# Altium project DevBoardSt107.PrjPcb
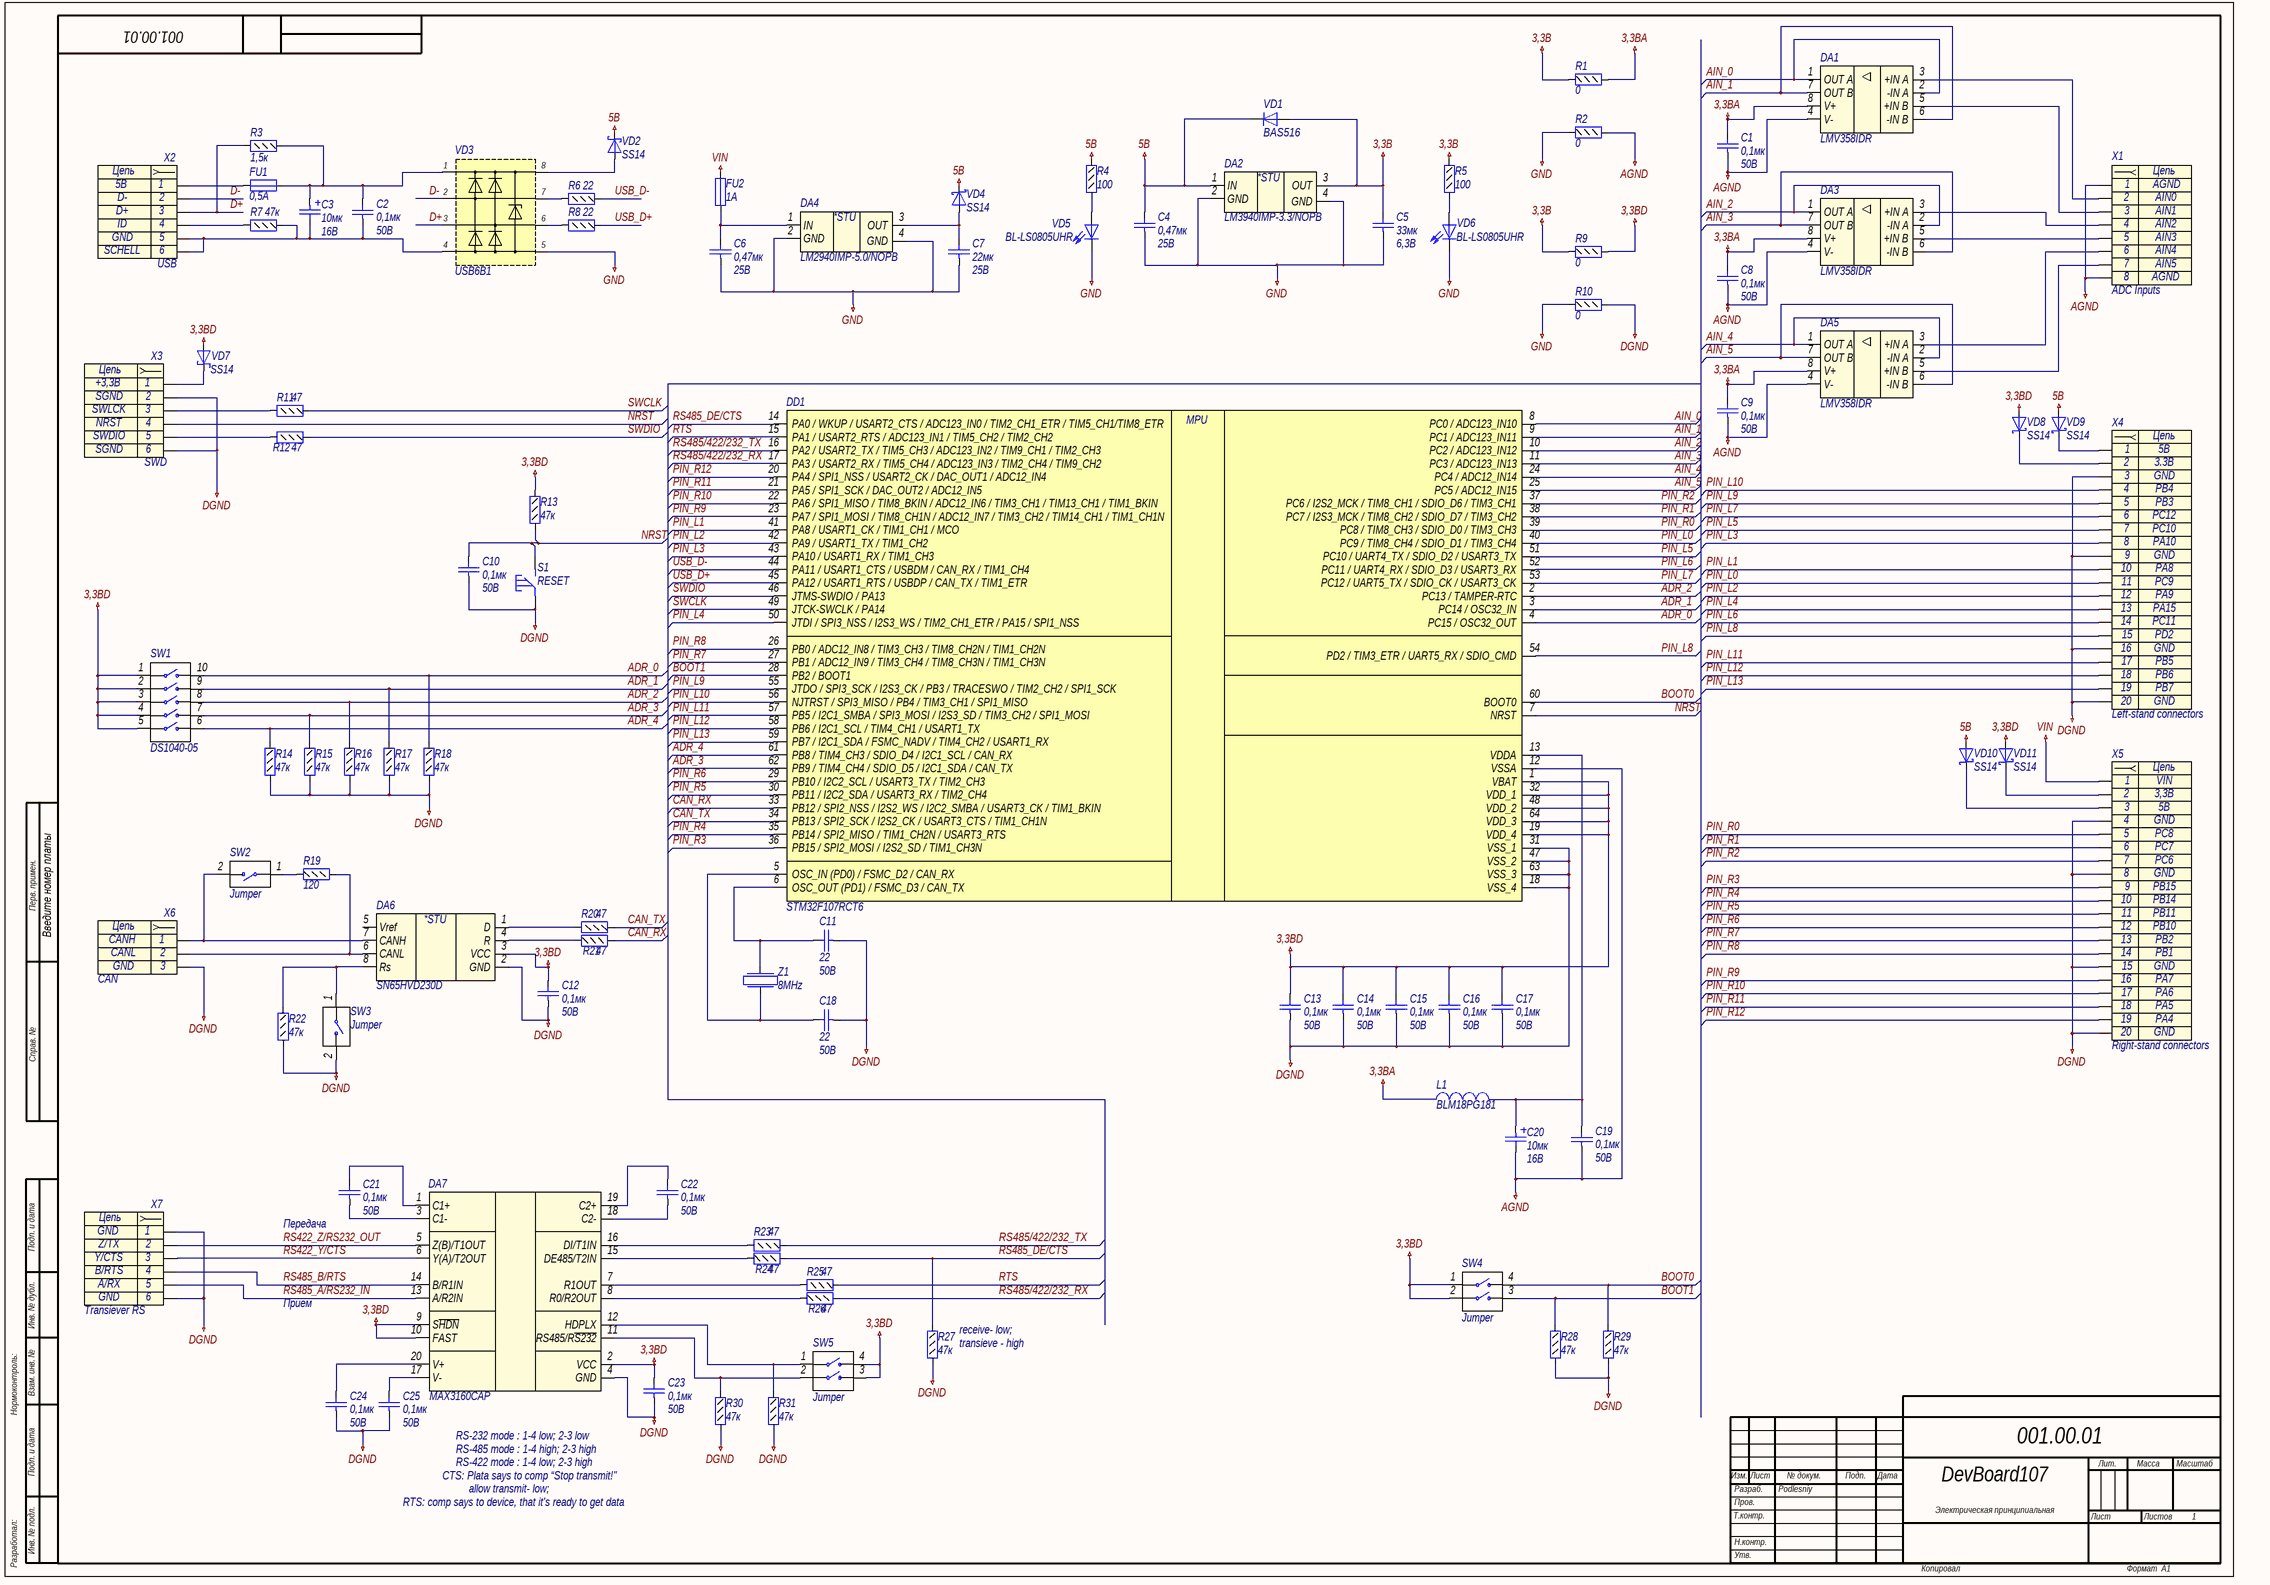
[diagram p0: DevBoardSt107.SchDoc]
1 sheet, 92 parts. Net scope: global (net labels, ports and power ports of the same name join across sheets).
Board file: DevBoardSt107.PcbDoc

## Sheet DevBoardSt107.SchDoc: DevBoard107
size 840 x 594 mm; DrawnBy: Podlesniy; DocumentNumber: 001.00.01; SheetTotal: 1; DocumentType: Электрическая принципиальная; Format: A1; ImagePath: Введите номер платы

### Parts
C1  0,1мк  Voltage: 50В  [C0603]
C2  0,1мк  Voltage: 50В  [C0603]
C3  10мк  Voltage: 16В  [TANTAL CASE B]
C4  0,47мк  Voltage: 25В  [C0603]
C5  33мк  Voltage: 6,3В  [C1210]
C6  0,47мк  Voltage: 25В  [C0603]
C7  22мк  Voltage: 25В  [C1210]
C8  0,1мк  Voltage: 50В  [C0603]
C9  0,1мк  Voltage: 50В  [C0603]
C10  0,1мк  Voltage: 50В  [C0603]
C11  22  Voltage: 50В  [C0603]
C12  0,1мк  Voltage: 50В  [C0603]
C13  0,1мк  Voltage: 50В  [C0603]
C14  0,1мк  Voltage: 50В  [C0603]
C15  0,1мк  Voltage: 50В  [C0603]
C16  0,1мк  Voltage: 50В  [C0603]
C17  0,1мк  Voltage: 50В  [C0603]
C18  22  Voltage: 50В  [C0603]
C19  0,1мк  Voltage: 50В  [C0603]
C20  10мк  Voltage: 16В  [TANTAL CASE B]
C21  0,1мк  Voltage: 50В  [C0603]
C22  0,1мк  Voltage: 50В  [C0603]
C23  0,1мк  Voltage: 50В  [C0603]
C24  0,1мк  Voltage: 50В  [C0603]
C25  0,1мк  Voltage: 50В  [C0603]
DA1  LMV358IDR  [SO8]
DA2  LM3940IMP-3.3/NOPB  [SOT-223]
DA3  LMV358IDR  [SO8]
DA4  LM2940IMP-5.0/NOPB  [SOT-223]
DA5  LMV358IDR  [SO8]
DA6  SN65HVD230D  [SO8]
DA7  MAX3160CAP  [SSOP20]
DD1  STM32F107RCT6  [LQFP64]
FU1  value 0,5A  [FUSE812]  (hidden comment: MF-MSMF050)
FU2  value 1A  [FUSE812]  (hidden comment: MF-MSMF075)
L1  Name: BLM18PG181  [L0603]  (hidden comment: XXX)
R1  0  [R0603]
R2  0  [R0603]
R3  1,5к  [R0603]
R4  100  [R0603]
R5  100  [R0603]
R6  22  [R0603]
R7  47к  [R0603]
R8  22  [R0603]
R9  0  [R0603]
R10  0  [R0603]
R11  47  [R0603]
R12  47  [R0603]
R13  47к  [R0603]
R14  47к  [R0603]
R15  47к  [R0603]
R16  47к  [R0603]
R17  47к  [R0603]
R18  47к  [R0603]
R19  120  [R0603]
R20  47  [R0603]
R21  47  [R0603]
R22  47к  [R0603]
R23  47  [R0603]
R24  47  [R0603]
R25  47  [R0603]
R26  47  [R0603]
R27  47к  [R0603]
R28  47к  [R0603]
R29  47к  [R0603]
R30  47к  [R0603]
R31  47к  [R0603]
S1  RESET  [DTSM 32]
SW1  DS1040-05  [DIP5]
SW2  Jumper  [PLS2-2]
SW3  Jumper  [PLS2-2]
SW4  Jumper  [PLS2-4]
SW5  Jumper  [PLS2-4]
VD1  BAS516  [SOD523]
VD2  SS14  [SMA]
VD3  USB6B1  [SO8]
VD4  SS14  [SMA]
VD5  BL-LS0805UHR  [D0805]
VD6  BL-LS0805UHR  [D0805]
VD7  SS14  [SMA]
VD8  SS14  [SMA]
VD9  SS14  [SMA]
VD10  SS14  [SMA]
VD11  SS14  [SMA]
X1  ADC Inputs  [PLS-8]
X2  USB  [USB-B Micro]
X3  SWD  [PLS2-6]
X4  Left-stand connectors  [PLS-20-2]
X5  Right-stand connectors  [PLS-20-2]
X6  CAN  [TERMINAL 3 way-2.54mm]
X7  Transiever RS  [TERMINAL 6 way-2.54mm]
Z1  8MHz  [QSMD5.0x3.2x1.0]

### Nets
3,3В: C5.2 DA2.3(OUT) R1.2 R5.2 R9.2 VD1.2(A)
3,3ВA: C1.2 C8.2 C9.2 DA1.8(V+) DA3.8(V+) DA5.8(V+) L1.1 R1.1
3,3ВD: C12.2 C13.2 C14.2 C15.2 C16.2 C17.2 C23.2 DA6.3(VCC) DA7.2(VCC) DA7.9(S~{HDN}) DA7.10(FAST) DD1.1(VBAT) DD1.19(VDD_4) DD1.32(VDD_1) DD1.48(VDD_2) DD1.64(VDD_3) R9.1 R13.2 SW1.1 SW1.2 SW1.3 SW1.4 SW1.5 SW4.1 SW4.2 SW5.3 SW5.4 VD7.2(A) VD8.2(A) VD11.2(A)
5В: C4.2 DA2.1(IN) R4.2 VD1.1(K) VD2.1(K) VD4.1(K) VD9.2(A) VD10.2(A)
AGND: C1.1 C8.1 C9.1 C19.1 C20.2 DA1.4(V-) DA3.4(V-) DA5.4(V-) DD1.12(VSSA) R2.1 X1.1 X1.8
DGND: C10.1 C11.1 C12.1 C13.1 C14.1 C15.1 C16.1 C17.1 C18.1 C23.1 C24.1 C25.1 DA6.2(GND) DA7.4(GND) DD1.18(VSS_4) DD1.31(VSS_1) DD1.47(VSS_2) DD1.63(VSS_3) R10.1 R14.1 R15.1 R16.1 R17.1 R18.1 R22.1 R27.1 R28.1 R29.1 R30.1 R31.1 S1.1 SW3.2 X3.2 X3.6 X4.3 X4.9 X4.16 X4.20 X5.4 X5.8 X5.15 X5.20 X6.3 X7.1 X7.6
GND: C4.1 C5.1 C6.1 C7.1 DA2.2(GND) DA2.4(GND) DA4.2(GND) DA4.4(GND) R2.2 R10.2 VD3.5 VD5.1(K) VD6.1(K)
VIN: FU2.2 X5.1
ADR_0: DD1.4(PC15_/_OSC32_OUT) R18.2 SW1.10
ADR_1: DD1.3(PC14_/_OSC32_IN) R17.2 SW1.9
ADR_2: DD1.2(PC13_/_TAMPER-RTC) R16.2 SW1.8
ADR_3: DD1.62(PB9_/_TIM4_CH4_/_SDIO_D5_/_I2C1_SDA_/_CAN_TX) R15.2 SW1.7
ADR_4: DD1.61(PB8_/_TIM4_CH3_/_SDIO_D4_/_I2C1_SCL_/_CAN_RX) R14.2 SW1.6
AIN_0: DA1.1(OUT_A) DA1.2(-IN_A) DD1.8(PC0_/_ADC123_IN10)
AIN_1: DA1.6(-IN_B) DA1.7(OUT_B) DD1.9(PC1_/_ADC123_IN11)
AIN_2: DA3.1(OUT_A) DA3.2(-IN_A) DD1.10(PC2_/_ADC123_IN12)
AIN_3: DA3.6(-IN_B) DA3.7(OUT_B) DD1.11(PC3_/_ADC123_IN13)
AIN_4: DA5.1(OUT_A) DA5.2(-IN_A) DD1.24(PC4_/_ADC12_IN14)
AIN_5: DA5.6(-IN_B) DA5.7(OUT_B) DD1.25(PC5_/_ADC12_IN15)
BOOT0: DD1.60(BOOT0) R29.2 SW4.4
BOOT1: DD1.28(PB2_/_BOOT1) R28.2 SW4.3
CAN_RX: DD1.33(PB12_/_SPI2_NSS_/_I2S2_WS_/_I2C2_SMBA_/_USART3_CK_/_TIM1_BKIN) R21.1
CAN_TX: DD1.34(PB13_/_SPI2_SCK_/_I2S2_CK_/_USART3_CTS_/_TIM1_CH1N) R20.2
D+: R3.1 VD3.3 X2.3
D-: VD3.2 X2.2
NRST: C10.2 DD1.7(NRST) R13.1 S1.4 X3.4
PIN_L0: DD1.40(PC9_/_TIM8_CH4_/_SDIO_D1_/_TIM3_CH4) X4.11
PIN_L1: DD1.41(PA8_/_USART1_CK_/_TIM1_CH1_/_MCO) X4.10
PIN_L2: DD1.42(PA9_/_USART1_TX_/_TIM1_CH2) X4.12
PIN_L3: DD1.43(PA10_/_USART1_RX_/_TIM1_CH3) X4.8
PIN_L4: DD1.50(JTDI_/_SPI3_NSS_/_I2S3_WS_/_TIM2_CH1_ETR_/_PA15_/_SPI1_NSS) X4.13
PIN_L5: DD1.51(PC10_/_UART4_TX_/_SDIO_D2_/_USART3_TX) X4.7
PIN_L6: DD1.52(PC11_/_UART4_RX_/_SDIO_D3_/_USART3_RX) X4.14
PIN_L7: DD1.53(PC12_/_UART5_TX_/_SDIO_CK_/_USART3_CK) X4.6
PIN_L8: DD1.54(PD2_/_TIM3_ETR_/_UART5_RX_/_SDIO_CMD) X4.15
PIN_L9: DD1.55(JTDO_/_SPI3_SCK_/_I2S3_CK_/_PB3_/_TRACESWO_/_TIM2_CH2_/_SPI1_SCK) X4.5
PIN_L10: DD1.56(NJTRST_/_SPI3_MISO_/_PB4_/_TIM3_CH1_/_SPI1_MISO) X4.4
PIN_L11: DD1.57(PB5_/_I2C1_SMBA_/_SPI3_MOSI_/_I2S3_SD_/_TIM3_CH2_/_SPI1_MOSI) X4.17
PIN_L12: DD1.58(PB6_/_I2C1_SCL_/_TIM4_CH1_/_USART1_TX) X4.18
PIN_L13: DD1.59(PB7_/_I2C1_SDA_/_FSMC_NADV_/_TIM4_CH2_/_USART1_RX) X4.19
PIN_R0: DD1.39(PC8_/_TIM8_CH3_/_SDIO_D0_/_TIM3_CH3) X5.5
PIN_R1: DD1.38(PC7_/_I2S3_MCK_/_TIM8_CH2_/_SDIO_D7_/_TIM3_CH2) X5.6
PIN_R2: DD1.37(PC6_/_I2S2_MCK_/_TIM8_CH1_/_SDIO_D6_/_TIM3_CH1) X5.7
PIN_R3: DD1.36(PB15_/_SPI2_MOSI_/_I2S2_SD_/_TIM1_CH3N) X5.9
PIN_R4: DD1.35(PB14_/_SPI2_MISO_/_TIM1_CH2N_/_USART3_RTS) X5.10
PIN_R5: DD1.30(PB11_/_I2C2_SDA_/_USART3_RX_/_TIM2_CH4) X5.11
PIN_R6: DD1.29(PB10_/_I2C2_SCL_/_USART3_TX_/_TIM2_CH3) X5.12
PIN_R7: DD1.27(PB1_/_ADC12_IN9_/_TIM3_CH4_/_TIM8_CH3N_/_TIM1_CH3N) X5.13
PIN_R8: DD1.26(PB0_/_ADC12_IN8_/_TIM3_CH3_/_TIM8_CH2N_/_TIM1_CH2N) X5.14
PIN_R9: DD1.23(PA7_/_SPI1_MOSI_/_TIM8_CH1N_/_ADC12_IN7_/_TIM3_CH2_/_TIM14_CH1_/_TIM1_CH1N) X5.16
PIN_R10: DD1.22(PA6_/_SPI1_MISO_/_TIM8_BKIN_/_ADC12_IN6_/_TIM3_CH1_/_TIM13_CH1_/_TIM1_BKIN) X5.17
PIN_R11: DD1.21(PA5_/_SPI1_SCK_/_DAC_OUT2_/_ADC12_IN5) X5.18
PIN_R12: DD1.20(PA4_/_SPI1_NSS_/_USART2_CK_/_DAC_OUT1_/_ADC12_IN4) X5.19
RS422_Y/CTS: DA7.6(Y(A)/T2OUT) X7.3
RS422_Z/RS232_OUT: DA7.5(Z(B)/T1OUT) X7.2
RS485/422/232_RX: DD1.17(PA3_/_USART2_RX_/_TIM5_CH4_/_ADC123_IN3_/_TIM2_CH4_/_TIM9_CH2) R26.1
RS485/422/232_TX: DD1.16(PA2_/_USART2_TX_/_TIM5_CH3_/_ADC123_IN2_/_TIM9_CH1_/_TIM2_CH3) R23.2
RS485_A/RS232_IN: DA7.13(A/R2IN) X7.5
RS485_B/RTS: DA7.14(B/R1IN) X7.4
RS485_DE/CTS: DD1.14(PA0_/_WKUP_/_USART2_CTS_/_ADC123_IN0_/_TIM2_CH1_ETR_/_TIM5_CH1/TIM8_ETR) R24.1 R27.2
RTS: DD1.15(PA1_/_USART2_RTS_/_ADC123_IN1_/_TIM5_CH2_/_TIM2_CH2) R25.2
SWCLK: DD1.49(JTCK-SWCLK_/_PA14) R11.2
SWDIO: DD1.46(JTMS-SWDIO_/_PA13) R12.2
USB_D+: DD1.45(PA12_/_USART1_RTS_/_USBDP_/_CAN_TX_/_TIM1_ETR) R8.2
USB_D-: DD1.44(PA11_/_USART1_CTS_/_USBDM_/_CAN_RX_/_TIM1_CH4) R6.2
NetC2_1: C2.1 C3.2 R7.2 VD3.4 X2.5 X2.6
NetC2_2: C2.2 C3.1 FU1.2 R3.2 VD3.1
NetC6_2: C6.2 DA4.1(IN) FU2.1
NetC7_2: C7.2 DA4.3(OUT) VD4.2(A)
NetC11_2: C11.2 DD1.6(OSC_OUT_(PD1)_/_FSMC_D3_/_CAN_TX) Z1.2
NetC18_2: C18.2 DD1.5(OSC_IN_(PD0)_/_FSMC_D2_/_CAN_RX) Z1.1
NetC19_2: C19.2 C20.1 DD1.13(VDDA) L1.2
NetC21_1: C21.1 DA7.3(C1-)
NetC21_2: C21.2 DA7.1(C1+)
NetC22_1: C22.1 DA7.18(C2-)
NetC22_2: C22.2 DA7.19(C2+)
NetC24_2: C24.2 DA7.20(V+)
NetC25_2: C25.2 DA7.17(V-)
NetDA1_3: DA1.3(+IN_A) X1.2
NetDA1_5: DA1.5(+IN_B) X1.3
NetDA3_3: DA3.3(+IN_A) X1.4
NetDA3_5: DA3.5(+IN_B) X1.5
NetDA5_3: DA5.3(+IN_A) X1.6
NetDA5_5: DA5.5(+IN_B) X1.7
NetDA6_1: DA6.1(D) R20.1
NetDA6_4: DA6.4(R) R21.2
NetDA6_6: DA6.6(CANL) R19.1 X6.2
NetDA6_7: DA6.7(CANH) SW2.2 X6.1
NetDA6_8: DA6.8(Rs) R22.2 SW3.1
NetDA7_7: DA7.7(R1OUT) R25.1
NetDA7_8: DA7.8(R0/R2OUT) R26.2
NetDA7_11: DA7.11(RS485/R~{S232}) R30.2 SW5.2
NetDA7_12: DA7.12(HDPLX) R31.2 SW5.1
NetDA7_15: DA7.15(DE485/T2IN) R24.2
NetDA7_16: DA7.16(DI/T1IN) R23.1
NetFU1_1: FU1.1 X2.1
NetR4_1: R4.1 VD5.2(A)
NetR5_1: R5.1 VD6.2(A)
NetR6_1: R6.1 VD3.7
NetR7_1: R7.1 X2.4
NetR8_1: R8.1 VD3.6
NetR11_1: R11.1 X3.3
NetR12_1: R12.1 X3.5
NetR19_2: R19.2 SW2.1
NetVD2_2: VD2.2(A) VD3.8
NetVD7_1: VD7.1(K) X3.1
NetVD8_1: VD8.1(K) X4.2
NetVD9_1: VD9.1(K) X4.1
NetVD10_1: VD10.1(K) X5.3
NetVD11_1: VD11.1(K) X5.2

Not connected (* = marked no-connect by the designer): DA6 5(Vref)

### Notes on the sheet
- Перв. примен.
- Справ. №
- Подп. и дата
- (near C21) Передача
- Инв. № дубл.
- Прием
- (near R27) receive- low;
- (near R27) transieve - high
- Нормоконтроль:
- Взам. инв. №
- RS-232 mode : 1-4 low; 2-3 low
- RS-485 mode : 1-4 high; 2-3 high
- CTS: Plata says to comp “Stop transmit!"
- RS-422 mode : 1-4 low; 2-3 high
- Изм.
- Лист
- № докум.
- Подп.
- Дата
- Лит.
- Масса
- Масштаб
- RTS: comp says to device, that it's ready to get data
- allow transmit- low;
- Т.контр.
- Пров.
- Разраб.
- Листов
- Разработал:
- Инв. № подл.
- Н.контр.
- Утв.
- Копировал
- Формат
- (in symbol Header_3_sct) Цепь
- (in symbol Header_6_sct) Цепь
- (in symbol Header_8_sct) Цепь
- (in symbol Header_20) Цепь
- (in symbol LM2940) *STU
- (in symbol LM3940) *STU
- (in symbol SN65HVD23x) *STU
- (in symbol STM32F107RCT6) MPU

### Library data of the parts
C1 C2 C4-C19 C21-C25 = Capacitor: Конденсатор
  C1 C2 C8-C10 C12-C17 C19 C21-C25: Value: 0,1мк
  C4 C6: Value: 0,47мк
  C5: Value: 33мк
  C7: Value: 22мк
  C11 C18: Value: 22
C3 C20 = Capacitor_pol: Конденсатор полярный; Value: 10мк
DA1 DA3 DA5 = LMV358IDR: Операционный усилитель ±6В; Name: LMV358IDR
DA2 = LM3940: Low-Dropout Regulator for 5-V to 3.3-V Conversion; Name: LM3940IMP-3.3/NOPB
DA4 = LM2940: Low-Dropout Regulator for 5-V to 3.3-V Conversion; Name: LM2940IMP-5.0/NOPB
DA6 = SN65HVD23x: 3,3V CAN TRANSCEIVERS; Name: SN65HVD230D
DA7 = MAX3160: райвер приемопередатчика RS232/RS422/RS485; Name: MAX3160CAP
DD1 = STM32F107RCT6: Микроконтроллер 64-pin; Name: STM32F107RCT6
FU1 FU2 = Fuse: Предохранитель
  FU1: Name: MF-MSMF050
  FU2: Name: MF-MSMF075
L1 = Inductor: Катушка индуктивности; Value: XXX
R1-R31 = Resistor_0,05Вт: Резистор
  R1 R2 R9 R10: Value: 0
  R3: Value: 1,5к
  R4 R5: Value: 100
  R6 R8: Value: 22
  R7 R13-R18 R22 R27-R31: Value: 47к
  R11 R12 R20 R21 R23-R26: Value: 47
  R19: Value: 120
S1 = Button_SMD: Кнопка; Name: RESET
SW1 = Switch 5-pin SMD: DIP переключатель; Name: DS1040-05
SW2 SW3 = Switch 1-pin SMD: DIP переключатель; Name: Jumper
SW4 SW5 = Switch 2-pin SMD: Переключатель адреса; Name: Jumper
VD1 = Diode: Диод; Name: BAS516
VD2 VD4 VD7-VD11 = DiodeSchottky: Диод Шоттки; Name: SS14
VD3 = USB6B1: Защита линии данных; Name: USB6B1
VD5 VD6 = LED_L: Светодиод; Name: BL-LS0805UHR
X1 = Header_8_sct: Разъем - 8 конт. розетка; Contact_2: AIN0; Contact_3: AIN1; Contact_4: AIN2; Contact_5: AIN3; Contact_6: AIN4; Contact_1: AGND; Contact_7: AIN5; Name: ADC Inputs; Contact_8: AGND
X2 = Header_6_sct: Разъем - 5 конт. розетка; Contact_1: 5B; Contact_2: D-; Contact_3: D+; Contact_4: ID; Contact_5: GND; Contact_6: SCHELL; Name: USB
X3 = Header_6_sct: Разъем - 5 конт. розетка; Contact_1: +3,3B; Contact_2: SGND; Contact_3: SWLCK; Contact_4: NRST; Contact_5: SWDIO; Name: SWD; Contact_6: SGND
X4 = Header_20: Разъем - 20 конт. розетка; Contact_1: 5B; Contact_2: 3.3B; Contact_3: GND; Contact_5: PB3; Contact_7: PC10; Contact_6: PC12; Contact_8: PA10; Contact_10: PA8; Contact_11: PC9; Contact_12: PA9; Contact_4: PB4; Contact_13: PA15; Contact_14: PC11; Contact_15: PD2; Contact_17: PB5; Contact_18: PB6; Contact_19: PB7; Name: Left-stand connectors; Contact_9: GND; Contact_16: GND; Contact_20: GND
X5 = Header_20: Разъем - 20 конт. розетка; Contact_1: VIN; Contact_2: 3,3B; Contact_3: 5B; Contact_5: PC8; Contact_7: PC6; Contact_6: PC7; Contact_8: GND; Contact_9: PB15; Contact_10: PB14; Contact_11: PB11; Contact_12: PB10; Contact_13: PB2; Contact_14: PB1; Contact_16: PA7; Contact_17: PA6; Contact_18: PA5; Contact_19: PA4; Name: Right-stand connectors; Contact_4: GND; Contact_15: GND; Contact_20: GND
X6 = Header_3_sct: Разъем - 2 конт. розетка; Contact_1: CANH; Contact_2: CANL; Contact_3: GND; Name: CAN
X7 = Header_6_sct: Разъем - 5 конт. розетка; Contact_1: GND; Contact_2: Z/TX; Contact_3: Y/CTS; Contact_4: B/RTS; Contact_5: A/RX; Name: Transiever RS; Contact_6: GND
Z1 = Crystal: Кварцевый резонатор; Value: 8MHz